# Altium schematic sheet [0X] LVDS, HDMI.SchDoc
size 513 x 386 mm
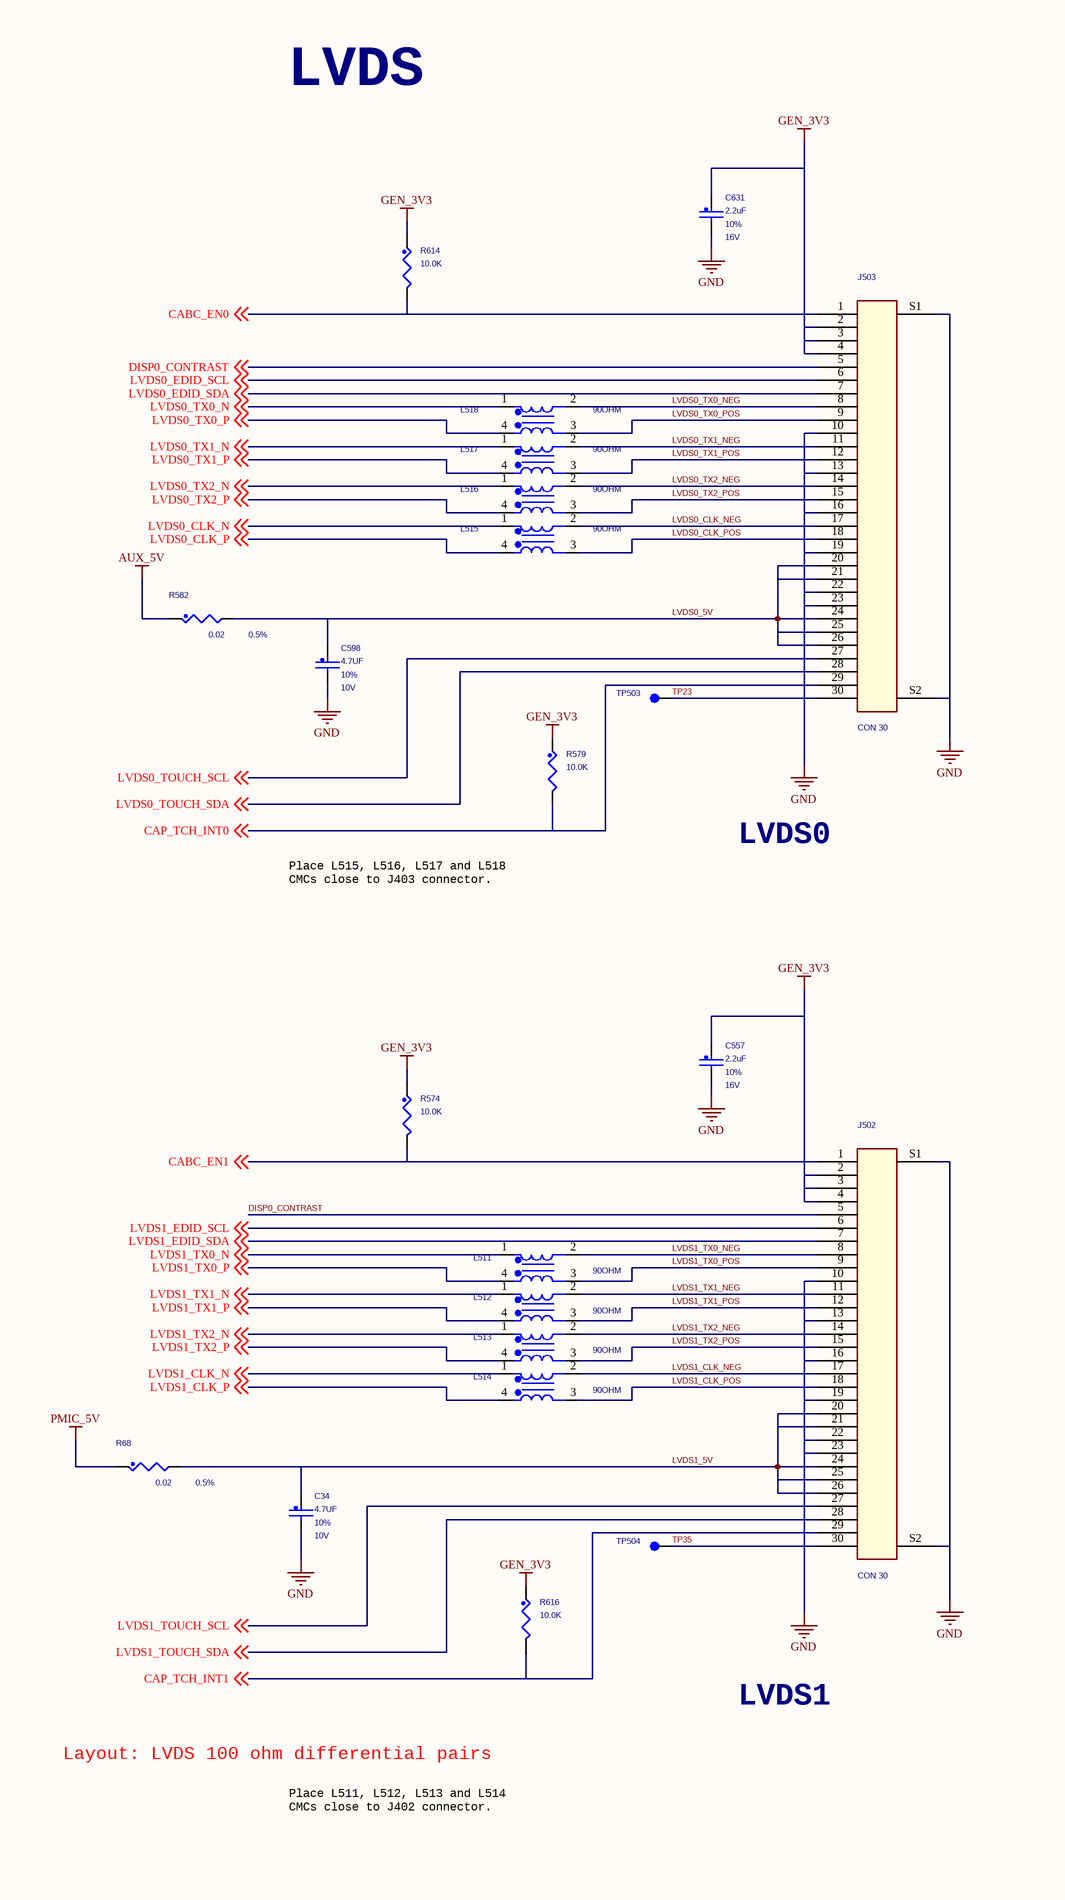
[diagram p0: [0X] LVDS, HDMI.SchDoc, left]
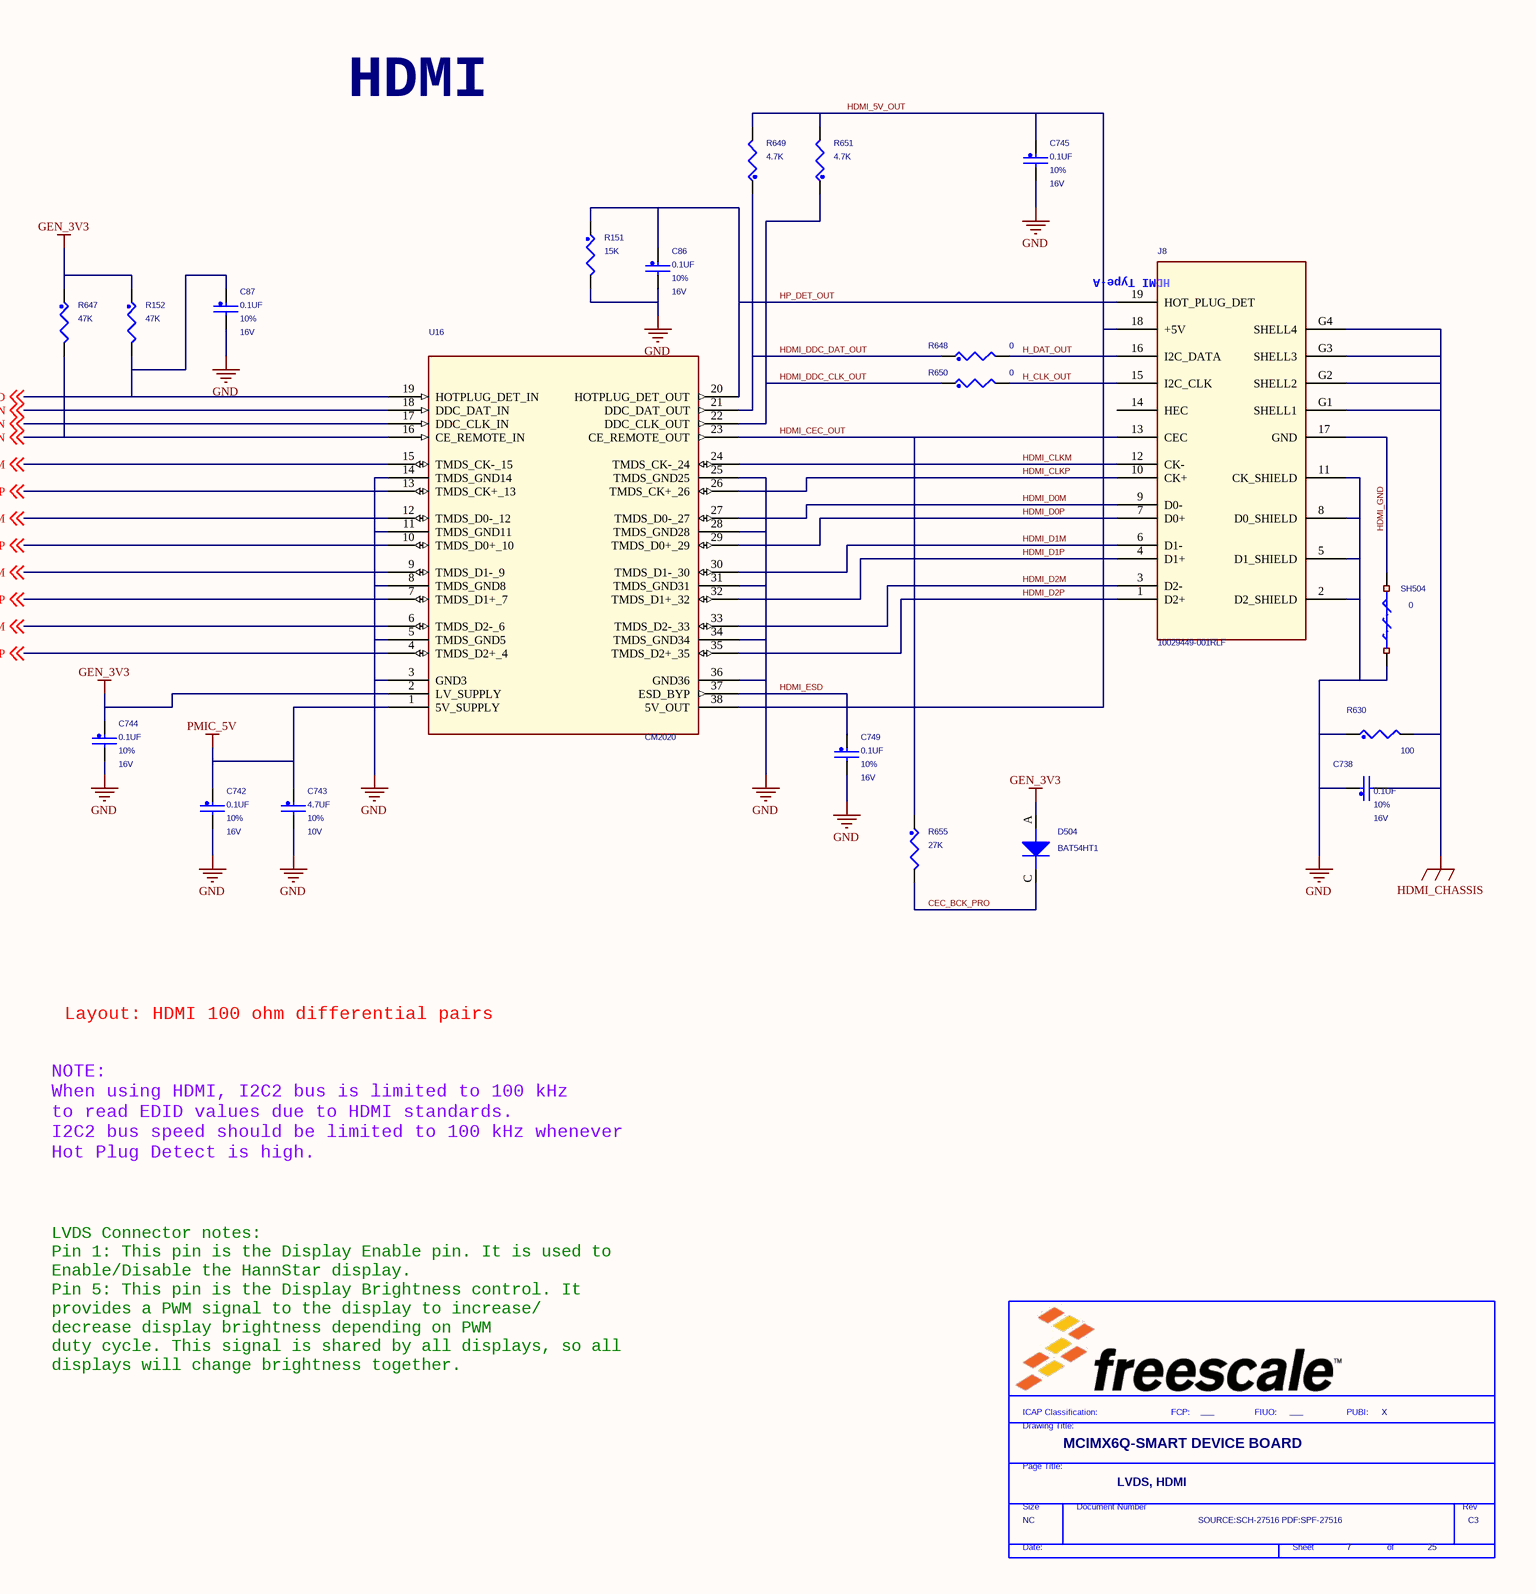
[diagram p1: [0X] LVDS, HDMI.SchDoc, right]

## Parts
*  FIUO: ___  PUBI: X  Doc: SOURCE:SCH-27516 PDF:SPF-27516  RevCode: C3  Title: MCIMX6Q-SMART DEVICE BOARD  Page Size: NC  Page Number: 7  Page Count: 25  PageTitle: LVDS, HDMI  (hidden comment: TitleBlock_FS)  (graphical)
C34  4.7UF  Tolerance: 10%  WVDC: 10V  [0603_CC]
C86  0.1UF  WVDC: 16V  Tolerance: 10%  [0402_CC]
C87  0.1UF  Tolerance: 10%  WVDC: 16V  [0402_CC]
C557  2.2uF  WVDC: 16V  Tolerance: 10%  [0603_CC]
C598  4.7UF  Tolerance: 10%  WVDC: 10V  [0603_CC]
C631  2.2uF  WVDC: 16V  Tolerance: 10%  [0603_CC]
C738  0.1UF  Tolerance: 10%  WVDC: 16V  [0402_CC]
C742  0.1UF  Tolerance: 10%  WVDC: 16V  [0402_CC]
C743  4.7UF  WVDC: 10V  Tolerance: 10%  [0603_CC]
C744  0.1UF  Tolerance: 10%  WVDC: 16V  [0402_CC]
C745  0.1UF  WVDC: 16V  Tolerance: 10%  [0402_CC]
C749  0.1UF  Tolerance: 10%  WVDC: 16V  [0402_CC]
D504  BAT54HT1  [SOD323]
J8  10029449-001RLF  [con_hdmi_19f_20_sm_ra]
J502  CON 30  [CON_DF_30F_1MM_SM_RA]
J503  CON 30  [CON_DF_30F_1MM_SM_RA]
L511  90OHM  [ind4_choke_0805]
L512  90OHM  [ind4_choke_0805]
L513  90OHM  [ind4_choke_0805]
L514  90OHM  [ind4_choke_0805]
L515  90OHM  [ind4_choke_0805]
L516  90OHM  [ind4_choke_0805]
L517  90OHM  [ind4_choke_0805]
L518  90OHM  [ind4_choke_0805]
R68  0.02  Tolerance: 0.5%  [0805_CC]
R151  15K  [0402_CC]
R152  47K  [0402_CC]
R574  10.0K  [0402_CC]
R579  10.0K  [0402_CC]
R582  0.02  Tolerance: 0.5%  [0805_CC]
R614  10.0K  [0402_CC]
R616  10.0K  [0402_CC]
R630  100  [0402_CC]
R647  47K  [0402_CC]
R648  0  [0402_CC]
R649  4.7K  [0402_CC]
R650  0  [0402_CC]
R651  4.7K  [0402_CC]
R655  27K  [0402_CC]
SH504  0  [SH0402_CC]
TP503  TEST POINT  [C035S]  (value not drawn)
TP504  TEST POINT  [C035S]  (value not drawn)
U16  CM2020  [tssop38_0p5_4p5x9p8]

## Nets
AUX_5V: R582.1
GEN_3V3: C557.1 C631.1 C744.1 D504.A(ANODE) J502.2 J502.3 J502.4 J503.2 J503.3 J503.4 R152.1 R574.1 R579.1 R614.1 R616.1 R647.1 U16.2(LV_SUPPLY)
GND: C34.2 C86.2 C87.2 C557.2 C598.2 C631.2 C738.1 C742.2 C743.2 C744.2 C745.2 C749.2 J8.2(D2_SHIELD) J8.5(D1_SHIELD) J8.8(D0_SHIELD) J8.11(CK_SHIELD) J502.10 J502.13 J502.16 J502.19 J502.22 J502.23 J502.S1 J502.S2 J503.10 J503.13 J503.16 J503.19 J503.22 J503.23 J503.S1 J503.S2 R151.2 R630.1 SH504.1 U16.3(GND3) U16.5(TMDS_GND5) U16.8(TMDS_GND8) U16.11(TMDS_GND11) U16.14(TMDS_GND14) U16.25(TMDS_GND25) U16.28(TMDS_GND28) U16.31(TMDS_GND31) U16.34(TMDS_GND34) U16.36(GND36)
HDMI_CHASSIS: C738.2 J8.G1(SHELL1) J8.G2(SHELL2) J8.G3(SHELL3) J8.G4(SHELL4) R630.2
PMIC_5V: C742.1 C743.1 R68.1 U16.1(5V_SUPPLY)
CABC_EN0: J503.1 R614.2 ; off-sheet CABC_EN0
CABC_EN1: J502.1 R574.2 ; off-sheet CABC_EN1
CAP_TCH_INT0: J503.29 R579.2 ; off-sheet CAP_TCH_INT0
CAP_TCH_INT1: J502.29 R616.2 ; off-sheet CAP_TCH_INT1
CEC_BCK_PRO: D504.C(CATHODE) R655.2
DISP0_CONTRAST: J502.5 J503.5 ; off-sheet DISP0_CONTRAST
H_CLK_OUT: J8.15(I2C_CLK) R650.2
H_DAT_OUT: J8.16(I2C_DATA) R648.2
HDMI_5V_OUT: C745.1 J8.18(+5V) R649.2 R651.2 U16.38(5V_OUT)
HDMI_CEC_IN: R647.2 U16.16(CE_REMOTE_IN) ; off-sheet HDMI_CEC_IN
HDMI_CEC_OUT: J8.13(CEC) R655.1 U16.23(CE_REMOTE_OUT)
HDMI_CLKM: J8.12(CK-) U16.15(TMDS_CK-_15) U16.24(TMDS_CK-_24) ; off-sheet HDMI_CLKM
HDMI_CLKP: J8.10(CK+) U16.13(TMDS_CK+_13) U16.26(TMDS_CK+_26) ; off-sheet HDMI_CLKP
HDMI_D0M: J8.9(D0-) U16.12(TMDS_D0-_12) U16.27(TMDS_D0-_27) ; off-sheet HDMI_D0M
HDMI_D0P: J8.7(D0+) U16.10(TMDS_D0+_10) U16.29(TMDS_D0+_29) ; off-sheet HDMI_D0P
HDMI_D1M: J8.6(D1-) U16.9(TMDS_D1-_9) U16.30(TMDS_D1-_30) ; off-sheet HDMI_D1M
HDMI_D1P: J8.4(D1+) U16.7(TMDS_D1+_7) U16.32(TMDS_D1+_32) ; off-sheet HDMI_D1P
HDMI_D2M: J8.3(D2-) U16.6(TMDS_D2-_6) U16.33(TMDS_D2-_33) ; off-sheet HDMI_D2M
HDMI_D2P: J8.1(D2+) U16.4(TMDS_D2+_4) U16.35(TMDS_D2+_35) ; off-sheet HDMI_D2P
HDMI_DDC_CLK_IN: U16.17(DDC_CLK_IN) ; off-sheet HDMI_DDC_CLK_IN
HDMI_DDC_CLK_OUT: R650.1 R651.1 U16.22(DDC_CLK_OUT)
HDMI_DDC_DAT_IN: U16.18(DDC_DAT_IN) ; off-sheet HDMI_DDC_DAT_IN
HDMI_DDC_DAT_OUT: R648.1 R649.1 U16.21(DDC_DAT_OUT)
HDMI_ESD: C749.1 U16.37(ESD_BYP)
HDMI_GND: J8.17(GND) SH504.2
HDMI_HPD: C87.1 R152.2 U16.19(HOTPLUG_DET_IN) ; off-sheet HDMI_HPD
HP_DET_OUT: C86.1 J8.19(HOT_PLUG_DET) R151.1 U16.20(HOTPLUG_DET_OUT)
LVDS0_5V: C598.1 J503.20 J503.21 J503.24 J503.25 J503.26 R582.2
LVDS0_CLK_N: L515.1 ; off-sheet LVDS0_CLK_N
LVDS0_CLK_NEG: J503.17 L515.2
LVDS0_CLK_P: L515.4 ; off-sheet LVDS0_CLK_P
LVDS0_CLK_POS: J503.18 L515.3
LVDS0_EDID_SCL: J503.6 ; off-sheet LVDS0_EDID_SCL
LVDS0_EDID_SDA: J503.7 ; off-sheet LVDS0_EDID_SDA
LVDS0_TOUCH_SCL: J503.27 ; off-sheet LVDS0_TOUCH_SCL
LVDS0_TOUCH_SDA: J503.28 ; off-sheet LVDS0_TOUCH_SDA
LVDS0_TX0_N: L518.1 ; off-sheet LVDS0_TX0_N
LVDS0_TX0_NEG: J503.8 L518.2
LVDS0_TX0_P: L518.4 ; off-sheet LVDS0_TX0_P
LVDS0_TX0_POS: J503.9 L518.3
LVDS0_TX1_N: L517.1 ; off-sheet LVDS0_TX1_N
LVDS0_TX1_NEG: J503.11 L517.2
LVDS0_TX1_P: L517.4 ; off-sheet LVDS0_TX1_P
LVDS0_TX1_POS: J503.12 L517.3
LVDS0_TX2_N: L516.1 ; off-sheet LVDS0_TX2_N
LVDS0_TX2_NEG: J503.14 L516.2
LVDS0_TX2_P: L516.4 ; off-sheet LVDS0_TX2_P
LVDS0_TX2_POS: J503.15 L516.3
LVDS1_5V: C34.1 J502.20 J502.21 J502.24 J502.25 J502.26 R68.2
LVDS1_CLK_N: L514.1 ; off-sheet LVDS1_CLK_N
LVDS1_CLK_NEG: J502.17 L514.2
LVDS1_CLK_P: L514.4 ; off-sheet LVDS1_CLK_P
LVDS1_CLK_POS: J502.18 L514.3
LVDS1_EDID_SCL: J502.6 ; off-sheet LVDS1_EDID_SCL
LVDS1_EDID_SDA: J502.7 ; off-sheet LVDS1_EDID_SDA
LVDS1_TOUCH_SCL: J502.27 ; off-sheet LVDS1_TOUCH_SCL
LVDS1_TOUCH_SDA: J502.28 ; off-sheet LVDS1_TOUCH_SDA
LVDS1_TX0_N: L511.1 ; off-sheet LVDS1_TX0_N
LVDS1_TX0_NEG: J502.8 L511.2
LVDS1_TX0_P: L511.4 ; off-sheet LVDS1_TX0_P
LVDS1_TX0_POS: J502.9 L511.3
LVDS1_TX1_N: L512.1 ; off-sheet LVDS1_TX1_N
LVDS1_TX1_NEG: J502.11 L512.2
LVDS1_TX1_P: L512.4 ; off-sheet LVDS1_TX1_P
LVDS1_TX1_POS: J502.12 L512.3
LVDS1_TX2_N: L513.1 ; off-sheet LVDS1_TX2_N
LVDS1_TX2_NEG: J502.14 L513.2
LVDS1_TX2_P: L513.4 ; off-sheet LVDS1_TX2_P
LVDS1_TX2_POS: J502.15 L513.3
TP23: J503.30 TP503.1(Pin1)
TP35: J502.30 TP504.1(Pin1)

Not connected (* = marked no-connect by the designer): J8 14(HEC)

## Notes on the sheet
- LVDS
- HDMI
- Place L515, L516, L517 and L518
  CMCs close to J403 connector.
- LVDS0
- NOTE:
  When using HDMI, I2C2 bus is limited to 100 kHz
  to read EDID values due to HDMI standards.
  I2C2 bus speed should be limited to 100 kHz whenever
  Hot Plug Detect is high.
- Layout: HDMI 100 ohm differential pairs
- LVDS Connector notes:
  Pin 1: This pin is the Display Enable pin. It is used to
  Enable/Disable the HannStar display.
  Pin 5: This pin is the Display Brightness control. It
  provides a PWM signal to the display to increase/
  decrease display brightness depending on PWM
  duty cycle. This signal is shared by all displays, so all
  displays will change brightness together.
- Layout: LVDS 100 ohm differential pairs
- LVDS1
- Place L511, L512, L513 and L514
  CMCs close to J402 connector.
- (in symbol CONN_HDMI_19P_TYPE_A) HDMI Type-A
- (in symbol TitleBlock_FS) ICAP Classification:; FCP:; FIUO:; PUBI:; Drawing Title:; Page Title:; Size; Document Number; Rev; Date:; Sheet; of

## Library data of the parts
* = TitleBlock_FS: OrgAddr2: Austin, TX 78735-8598; OrgAddr1: 6501 William Cannon Drive West; OrgName: Freescale Semiconductor; FCP: ___; Page Create Date: March  8, 1995
C34 = CAP_NP: CAP CER 4.7UF 10V 10% X5R 0603; CLASS: DISCRETE; PRIORITY_PN: 021-00276; FPLIST: CC0603_OV,CC0603,0603_CC; CAD_APPROVED: Yes; MFG_PN01: LMK107BJ475KA-T; MFG_NAME01: TAIYO YUDEN; AGILE_PN: 150-77975; ROOM: ATLAS-AP; SIGNAL_MODEL: DEFAULT_CAPACITOR_4.7e+06pF_2_1; HEIGHT: 0.9MM; ROHS: Yes; VOLTAGE: 10V
C86 C87 C745 = CAP_NP: CAP CER 0.1UF 16V 10% X7R 0402; CLASS: DISCRETE; AGILE_PN: 150-75182; MFG_NAME01: KEMET; MFG_PN01: C0402C104K4RAC; CAD_APPROVED: Yes; FPLIST: CC0402_25,CC0402_HD,0402_CC; SIGNAL_MODEL: DEFAULT_CAPACITOR_100000pF_2_1; ROHS: Yes; HEIGHT: 0.635MM; VOLTAGE: 16V
C557 = CAP_NP: CAP CER 2.2UF 16V 10% X5R 0603; CLASS: DISCRETE; FPLIST: CC0603_OV,CC0603,0603_CC; CAD_APPROVED: YES; MFG_PN01: GRM188R61C225KE15D; MFG_NAME01: MURATA; AGILE_PN: 150-75417; SIGNAL_MODEL: DEFAULT_CAPACITOR_2.2e+06pF_2_1; HEIGHT: 0.9 MM; ROHS: Yes; VOLTAGE: 16V
C598 = CAP_NP: CAP CER 4.7UF 10V 10% X5R 0603; CLASS: DISCRETE; ROOM: ATLAS-AP; AGILE_PN: 150-77975; MFG_NAME01: TAIYO YUDEN; MFG_PN01: LMK107BJ475KA-T; CAD_APPROVED: Yes; FPLIST: CC0603_OV,CC0603,0603_CC; PRIORITY_PN: 021-00276; SIGNAL_MODEL: DEFAULT_CAPACITOR_4.7e+06pF_2_1; ROHS: Yes; HEIGHT: 0.9MM; VOLTAGE: 10V
C631 = CAP_NP: CAP CER 2.2UF 16V 10% X5R 0603; CLASS: DISCRETE; AGILE_PN: 150-75417; MFG_NAME01: MURATA; MFG_PN01: GRM188R61C225KE15D; CAD_APPROVED: YES; FPLIST: CC0603_OV,CC0603,0603_CC; SIGNAL_MODEL: DEFAULT_CAPACITOR_2.2e+06pF_2_1; ROHS: Yes; HEIGHT: 0.9 MM; VOLTAGE: 16V
C738 C742 C744 C749 = CAP_NP: CAP CER 0.1UF 16V 10% X7R 0402; CLASS: DISCRETE; FPLIST: CC0402_25,CC0402_HD,0402_CC; CAD_APPROVED: Yes; MFG_PN01: C0402C104K4RAC; MFG_NAME01: KEMET; AGILE_PN: 150-75182; SIGNAL_MODEL: DEFAULT_CAPACITOR_100000pF_2_1; HEIGHT: 0.635MM; ROHS: Yes; VOLTAGE: 16V
C743 = CAP_NP: CAP CER 4.7UF 10V 10% X5R 0603; CLASS: DISCRETE; AGILE_PN: 150-77975; MFG_NAME01: TAIYO YUDEN; MFG_PN01: LMK107BJ475KA-T; CAD_APPROVED: Yes; FPLIST: CC0603_OV,CC0603,0603_CC; SIGNAL_MODEL: DEFAULT_CAPACITOR_4.7e+06pF_2_1; ROHS: Yes; HEIGHT: 0.9MM; VOLTAGE: 10V
D504 = DIODE: DIODE SCH 30V 200MA -- SOD323; CLASS: IC; AGILE_PN: 480-30039; MFG_NAME01: ON SEMICONDUCTOR; MFG_PN01: BAT54HT1G; CAD_APPROVED: Yes; ROHS: Yes; HEIGHT: 1.15MM
J8 = CONN_HDMI_19P_TYPE_A: CON 19 HDMI_TYPE_A RA SKT 20MIL SP 248H AU; AGILE_PN: 211-78907; MFG_NAME01: FCI; CAD_APPROVED: Yes; MFG_PN01: 10029449-001RLF; ROHS: Yes; HEIGHT: 6.3MM
J502 J503 = CON30_DF19G-30P-1H: CON 30 SHRD SKT RA SMT 1MM SP AU; CLASS: IO; CAD_APPROVED: Yes; MFG_PN01: DF19G-30P-1H(56); MFG_NAME01: HIROSE; AGILE_PN: 211-77164; HEIGHT: 1.65MM; ROHS: Yes
L511-L513 L517 L518 = DLW43: IND CHK 90 OHM@100MHZ 330MA 25% 0805; PART_TYPE: CHOKE; CLASS: DISCRETE; CAD_APPROVED: Yes; MFG_PN01: DLW21HN900SQ2L; MFG_NAME01: MURATA; AGILE_PN: 180-76336; HEIGHT: 1MM; ROHS: Yes; Tolerance: 25%
L514-L516 = DLW43: IND CHK 90 OHM@100MHZ 330MA 25% 0805; PART_TYPE: CHOKE; CLASS: DISCRETE; AGILE_PN: 180-76336; MFG_NAME01: MURATA; MFG_PN01: DLW21HN900SQ2L; CAD_APPROVED: Yes; Tolerance: 25%; ROHS: Yes; HEIGHT: 1MM
R68 R582 = RES: RES MF 0.02OHM 1/4W 0.5% 0805; CLASS: DISCRETE; AGILE_PN: 470-79241; MFG_NAME01: VISHAY INTERTECHNOLOGY; MFG_PN01: WSL0805R0200DEA18; CAD_APPROVED: Yes; FPLIST: RC0805_OV,RC0805,0805_CC; SIGNAL_MODEL: DEFAULT_RESISTOR_0.02OHM_2_1; ROHS: Yes
R151 = RES: RES MF 15K 1/16W 5% 0402; CLASS: DISCRETE; FPLIST: RC0402_25,RC0402_HD,0402_CC; CAD_APPROVED: Yes; MFG_PN01: CRCW040215K0JNED; MFG_NAME01: VISHAY INTERTECHNOLOGY; Tolerance: %5; AGILE_PN: 470-30313; SIGNAL_MODEL: DEFAULT_RESISTOR_15000OHM_2_1; ROHS: Yes
R152 = RES: RES MF 47K 1/16W 5% 0402; CLASS: DISCRETE; FPLIST: RC0402_25,RC0402_HD,0402_CC; CAD_APPROVED: Yes; MFG_PN01: CR0402-16W-473JT; MFG_NAME01: VENKEL COMPANY; AGILE_PN: 470-75559; SIGNAL_MODEL: DEFAULT_RESISTOR_47000OHM_2_1; ROHS: Yes; Tolerance: 5%
R574 R579 R614 R616 = RES: RES MF 10.0K 1/16W 1% 0402; CLASS: DISCRETE; AGILE_PN: 470-75416; MFG_NAME01: VISHAY INTERTECHNOLOGY; MFG_PN01: CRCW040210K0FKED; CAD_APPROVED: Yes; FPLIST: RC0402_25,RC0402_HD,0402_CC; SIGNAL_MODEL: DEFAULT_RESISTOR_10000OHM_2_1; Tolerance: 1%; ROHS: Yes
R630 = RES: RES MF 100 OHM 1/16W 1% 0402; CLASS: DISCRETE; FPLIST: RC0402_25,RC0402_HD,0402_CC; CAD_APPROVED: Yes; MFG_PN01: CR-02FL6--100R; MFG_NAME01: THYE MING TECH CO LTD; AGILE_PN: 470-30454; SIGNAL_MODEL: DEFAULT_RESISTOR_100OHM_2_1; ROHS: Yes; Tolerance: 1%
R647 = RES: RES MF 47K 1/16W 5% 0402; CLASS: DISCRETE; AGILE_PN: 470-75559; MFG_NAME01: VENKEL COMPANY; MFG_PN01: CR0402-16W-473JT; CAD_APPROVED: Yes; FPLIST: RC0402_25,RC0402_HD,0402_CC; SIGNAL_MODEL: DEFAULT_RESISTOR_47000OHM_2_1; Tolerance: 5%; ROHS: Yes
R648 = RES: RES MF ZERO OHM 1/10W -- 0402; CLASS: DISCRETE; AGILE_PN: 470-79965; MFG_NAME01: Panasonic; MFG_PN01: ERJ-2GE0R00X; CAD_APPROVED: Yes; FPLIST: RC0402_25,RC0402_HD,RC0402_X2,0402_CC; PRIORITY_PN: 006-00559; ROOM: HDMI; SIGNAL_MODEL: DEFAULT_RESISTOR_0.001OHM_2_1; ROHS: Yes
R649 R651 = RES: RES MF 4.70K 1/16W 1% 0402; CLASS: DISCRETE; PRIORITY_PN: 006-00619; CAD_APPROVED: Yes; MFG_PN01: RK73H1ETTP4701F; MFG_NAME01: KOA SPEER; AGILE_PN: 470-75418; SIGNAL_MODEL: DEFAULT_RESISTOR_4700OHM_2_1; Tolerance: 1%; ROHS: Yes
R650 = RES: RES MF ZERO OHM 1/10W -- 0402; CLASS: DISCRETE; ROOM: HDMI; PRIORITY_PN: 006-00559; FPLIST: RC0402_25,RC0402_HD,RC0402_X2,0402_CC; CAD_APPROVED: Yes; MFG_PN01: ERJ-2GE0R00X; MFG_NAME01: Panasonic; AGILE_PN: 470-79965; SIGNAL_MODEL: DEFAULT_RESISTOR_0.001OHM_2_1; ROHS: Yes
R655 = RES: RES MF 27K 1/16W 5% 0402; CLASS: DISCRETE; AGILE_PN: 470-76069; MFG_NAME01: VISHAY INTERTECHNOLOGY; MFG_PN01: CRCW040227K0JNED; CAD_APPROVED: Yes; FPLIST: RC0402_25,RC0402_HD,0402_CC; SIGNAL_MODEL: DEFAULT_RESISTOR_27000OHM_2_1; Tolerance: 5%; ROHS: Yes
SH504 = RES_SHORT-2: ZERO OHM CUT TRACE 0402 PADS; NO PART TO ORDER; CLASS: DISCRETE; SIGNAL_MODEL: DEFAULT_RESISTOR_0.001OHM_2_1; AGILE_PN: 470-76449; MFG_NAME01: LAYOUT ELEMENT ONLY; ASSY_OPT: DNP; CAD_APPROVED: Yes; FPLIST: SH0402,SH0402_CC; MFG_PN01: LAYOUT ELEMENT ONLY; ROHS: Yes
TP503 TP504 = Test pad: TEST POINT PAD 35 MIL SMT, NO PART TO ORDER; CLASS: IC; CAD_APPROVED: Yes; ASSY_OPT: DNP; MFG_PN01: NA; AGILE_PN: 280-75148; HEIGHT: 0.1 MM; ROHS: Yes; MFG_NAME01: NA
U16 = CM2020_TSSOP_38P: IC XMTR HDMI ESD PROTECTION 5V TSSOP38; AGILE_PN: 312-80388; MFG_NAME01: ON SEMICONDUCTOR; MFG_PN01: CM2020-01TR; CAD_APPROVED: Yes; CLASS: IC; ROHS: Yes; HEIGHT: 1.2MM